# EasyEDA Pro project ProDoc_飞镖核心板_2.5.0_2025-09-09.epro, board PCB1
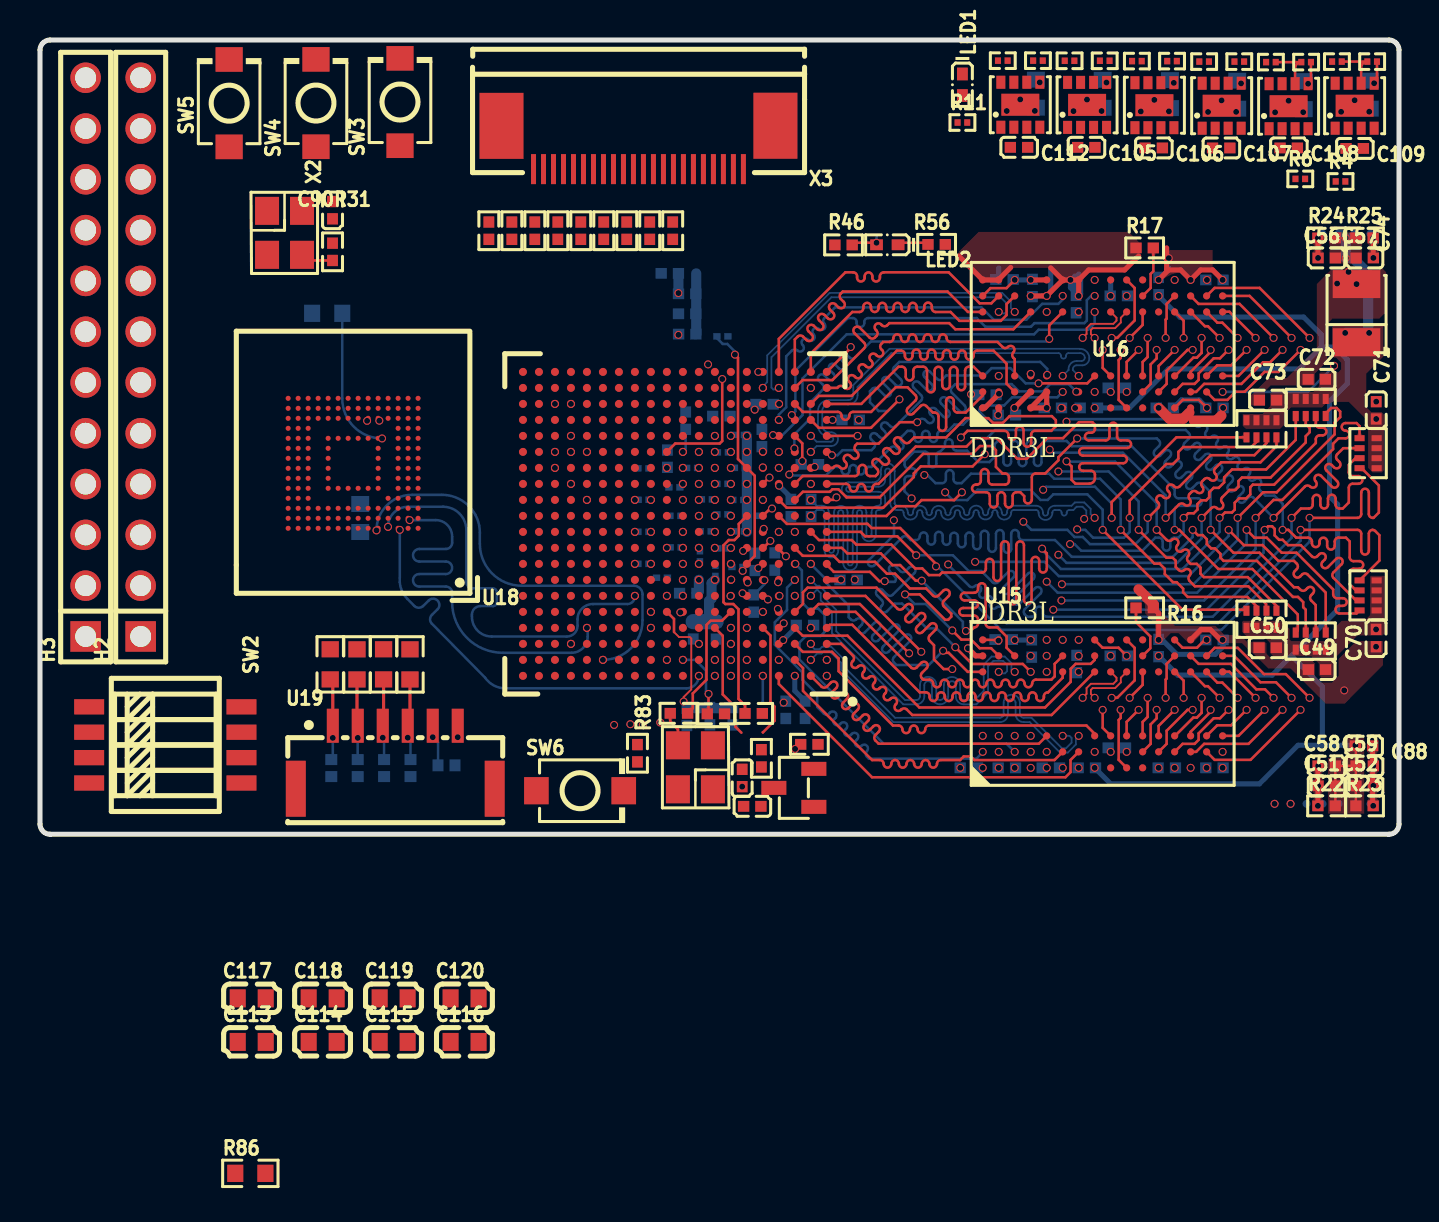
[diagram p7: board, top side]
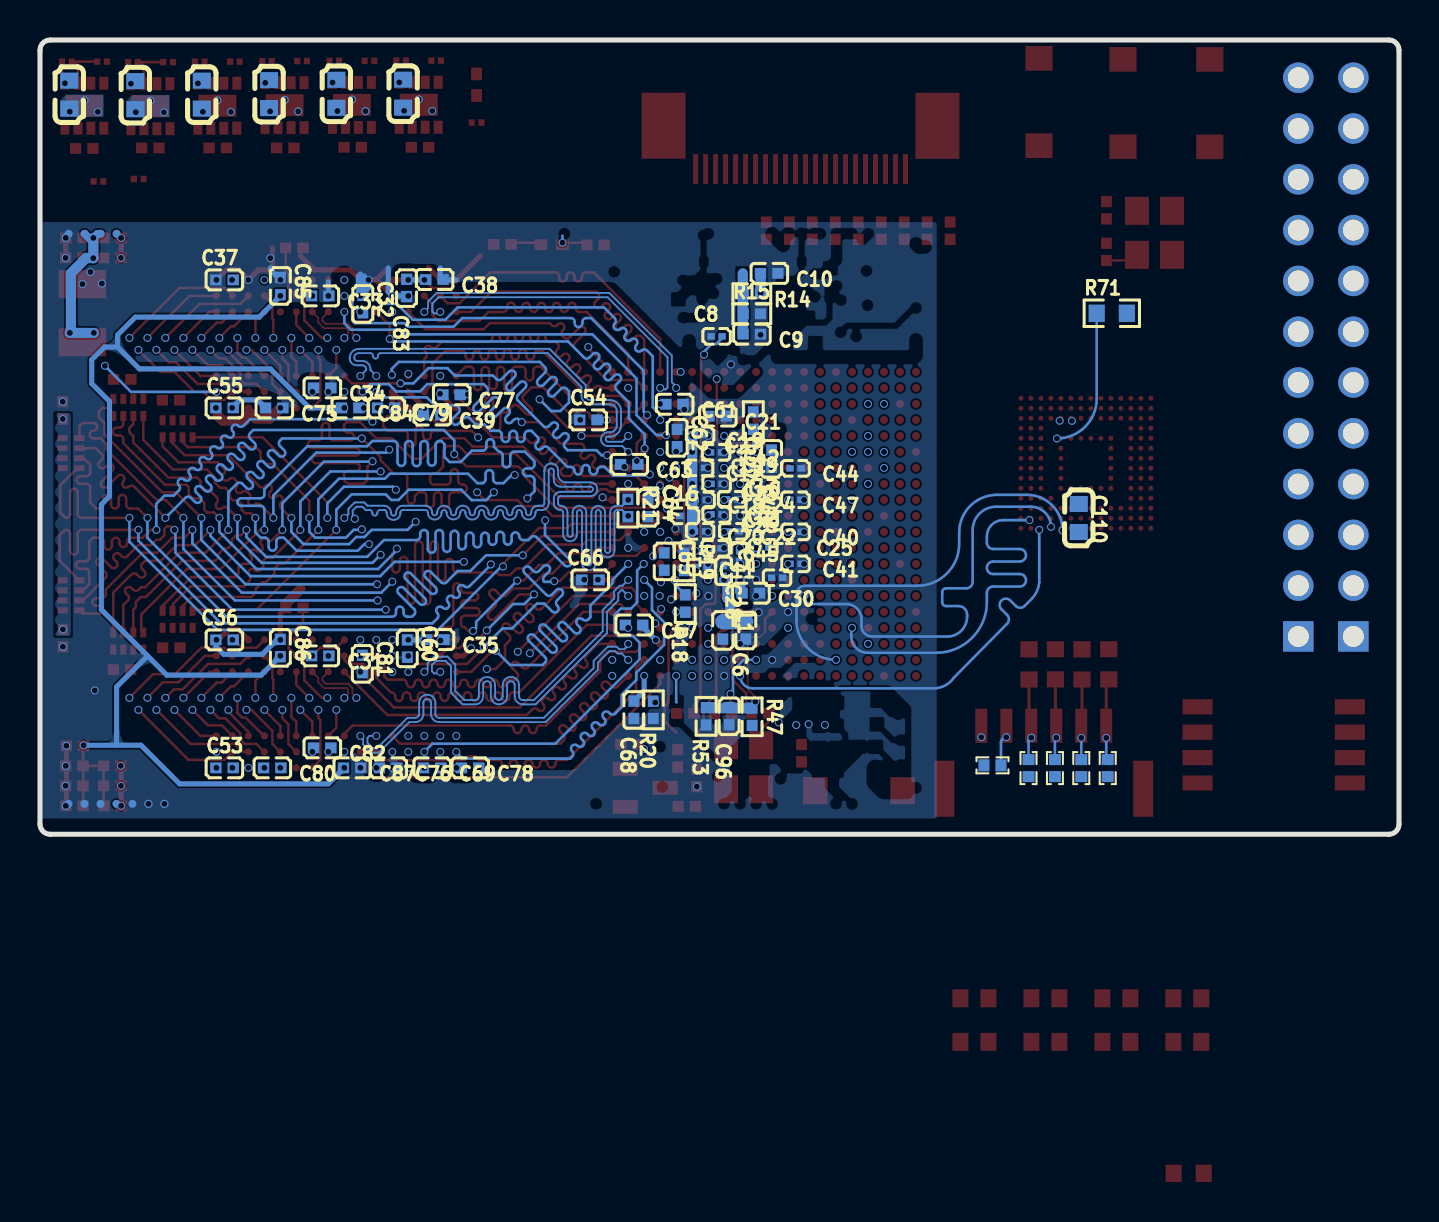
[diagram p8: board, bottom side, seen from below]

Outline 67.99 x 39.72 mm; copper layers: Top Layer, 地层1, 电源层, 信号层, 地层2, Bottom Layer. Coordinates in mm from the lower left corner of the outline.
Outline path: 0,39.21 0,0.51 arc(0.15,0.15) 0.51,0 67.48,0 arc(67.84,0.15) 67.99,0.51 67.99,39.21 arc(67.84,39.57) 67.48,39.72 0.51,39.72 arc(0.15,39.57) 0,39.21
Stack: Top Layer 0.035mm 外层铜厚1oz / Dielectric1 0.0994mm 3313 RC57% 4.2mil / 地层1 0.035mm / Dielectric2 0.55mm 0.55mm H/H No copper / 电源层 0.035mm / Dielectric3 0.1088mm 2116 RC54% 4.9mil / 信号层 0.035mm / Dielectric4 0.55mm 0.55mm H/H No copper / 地层2 0.035mm / Dielectric5 0.0994mm 3313 RC57% 4.2mil / Bottom Layer 0.035mm 外层铜厚1oz

## Design rules (mm)
net SDQS0N: DP4
net SDQS0P: DP4
net SDQS1N: DP3
net SDQS1P: DP3
net SCKP: DP1
net SCKN: DP1
net SDQS2P: DP5
net SDQS2N: DP5
net SDQS3N: DP2
net SDQS3P: DP2
net PL_MIPI_MDP_0: DP6
net PL_MIPI_MDN_0: DP6
net MIPI_MDN_0: DP7
net MIPI_MDP_0: DP7
template: 自定义配置
spacing copperThickness1oz (default): track to track 0.089, other pairs 0.089 to 0.3
spacing copperThickness2oz: track to track 0.203, other pairs 0.152 to 0.3
track width copperThickness1oz (default): min 0.089, default 0.127, max 2.54
track width copperThickness2oz: min 0.203, default 0.254, max 2.54
differential pair differentialPair (default): width min 0.089, default 0.089, max 2.54; gap min 0.124, default 0.127
via viaSize (default): diameter min 0.399, default 0.399, max 10; hole min 0.3, default 0.3, max 6.299
net SDQM0 uses DQ0~7
net SDQ2 uses DQ0~7
net SDQ3 uses DQ0~7
net SDQ6 uses DQ0~7
net SDQ5 uses DQ0~7
net SDQ7 uses DQ0~7
net SDQM1 uses DQ8~15
net SDQ14 uses DQ8~15
net SDQ15 uses DQ8~15
net SDQS0N uses DQ0~7
net SDQ1 uses DQ0~7
net SDQS0P uses DQ0~7
net SDQ0 uses DQ0~7
net SDQ4 uses DQ0~7
net SA13 uses SA
net SDQ8 uses DQ8~15
net SDQ9 uses DQ8~15
net SA12 uses SA
net SDQS1N uses DQ8~15
net SA14 uses SA
net SA11 uses SA
net SDQ10 uses DQ8~15
net SDQS1P uses DQ8~15
net SDQ13 uses DQ8~15
net SDQ11 uses DQ8~15
net SA9 uses SA
net SDQ12 uses DQ8~15
net SA8 uses SA
net SA1 uses SA
net SA3 uses SA
net SA7 uses SA
net SA6 uses SA
net SCKP uses CLK
net SA5 uses SA
net SCKN uses CLK
net SA2 uses SA
net SA4 uses SA
net SRAS uses SA
net SBA1 uses SA
net SCKE uses SA
net SA0 uses SA
net SCS uses SA
net SA10 uses SA
net SBA2 uses SA
net SBA0 uses SA
net SWE uses SA
net SCAS uses SA
net SODT uses SA
net SDQ18 uses DQ16~23
net SDQ17 uses DQ16~23
net SDQS2P uses DQ16~23
net SDQ16 uses DQ16~23
net SDQ19 uses DQ16~23
net SDQM2 uses DQ16~23
net SDQS2N uses DQ16~23
net SDQ20 uses DQ16~23
net SDQ24 uses DQ24~31
net SDQ26 uses DQ24~31
net SDQM3 uses DQ24~31
net SDQ28 uses DQ24~31
net SDQ25 uses DQ24~31
net SDQ27 uses DQ24~31
net SDQ29 uses DQ24~31
net SDQS3N uses DQ24~31
net SDQS3P uses DQ24~31
net SDQ30 uses DQ24~31
net SDQ31 uses DQ24~31
net SDQ22 uses DQ16~23
net SDQ23 uses DQ16~23
net SDQ21 uses DQ16~23
eq len grp DQ0~7 uses DQ0~7
eq len grp DQ8~15 uses DQ8~15
eq len grp SA uses SA
eq len grp CLK uses CLK
eq len grp DQ16~23 uses DQ16~23
eq len grp DQ24~31 uses DQ24~31
region e454 uses 1
region e455 uses 1
region e456 uses 1

## Placement (name value [footprint] x y rotation side)
C1  22uF  [C0603]  66.52 36.99 90 bottom
C2  22uF  [C0603]  63.22 36.96 90 bottom
C3  22uF  [C0603]  59.89 36.99 90 bottom
C4  22uF  [C0603]  56.53 37.01 90 bottom
C5  22uF  [C0603]  53.16 37.03 90 bottom
C6  10uF  [C0402_NEW]  32.68 10.19 90 bottom
C7  470nF  [c0201]  33.79 13.17 270 bottom
C8  100nF  [c0201]  34.14 24.9 180 bottom
C9  10nF  [C0402_NEW]  32.37 25.01 0 bottom
C10  100nF  [C0402_NEW]  31.5 28.05 0 bottom
C11  100nF  [c0201]  34.89 13.37 0 bottom
C16  100nF  [c0201]  35.71 15.92 180 bottom
C17  100nF  [c0201]  35.01 18.32 0 bottom
C18  100nF  [c0201]  34.94 16.72 0 bottom
C19  100nF  [c0201]  34.96 19.97 0 bottom
C20  100nF  [c0201]  34.96 15.15 0 bottom
C21  10uF  [C0402_NEW]  34.08 20.91 0 bottom
C22  100nF  [c0201]  33.3 15.15 0 bottom
C23  100nF  [c0201]  31.79 15.92 180 bottom
C24  100nF  [c0201]  33.36 16.75 0 bottom
C25  100nF  [c0201]  31.11 12.83 0 bottom
C26  100nF  [c0201]  31.8 14.35 180 bottom
C27  100nF  [c0201]  32.62 18.32 180 bottom
C28  100nF  [c0201]  33.01 13.9 90 bottom
C29  100nF  [c0201]  31.74 17.35 180 bottom
C30  10uF  [C0402_NEW]  32.42 12.06 0 bottom
C31  100nF  [C0402_NEW]  53.96 8.92 0 bottom
C32  100nF  [C0402_NEW]  51.83 26.52 270 bottom
C33  100nF  [C0402_NEW]  53.96 26.92 0 bottom
C34  100nF  [C0402_NEW]  53.86 22.32 0 bottom
C35  100nF  [C0402_NEW]  48.2 9.74 0 bottom
C36  100nF  [C0402_NEW]  58.76 9.72 180 bottom
C37  100nF  [C0402_NEW]  58.76 27.72 180 bottom
C38  100nF  [C0402_NEW]  48.24 27.74 0 bottom
C39  10uF  [C0402_NEW]  48.36 20.97 0 bottom
C40  100nF  [c0201]  30.19 15.12 0 bottom
C41  100nF  [c0201]  30.19 13.52 0 bottom
C42  100nF  [c0201]  34.16 19.1 0 bottom
C43  100nF  [c0201]  34.14 16 0 bottom
C44  100nF  [c0201]  30.19 18.3 0 bottom
C45  100nF  [c0201]  34.19 14.3 0 bottom
C46  100nF  [c0201]  34.14 17.52 0 bottom
C47  100nF  [c0201]  30.2 16.73 0 bottom
C48  10uF  [C0402_NEW]  31.39 18.77 90 bottom
C49  100nF  [C0402_NEW]  63.87 8.24 0 top
C50  100nF  [C0402_NEW]  61.41 9.33 0 top
C51  100nF  [C0402_NEW]  64.36 2.42 0 top
C52  100nF  [C0402_NEW]  66.26 2.42 0 top
C53  100nF  [C0402_NEW]  58.76 3.32 180 bottom
C54  100nF  [C0402_NEW]  40.56 20.72 180 bottom
C55  100nF  [C0402_NEW]  58.76 21.32 180 bottom
C56  100nF  [C0402_NEW]  64.36 28.82 0 top
C57  100nF  [C0402_NEW]  66.26 28.82 0 top
C58  10nF  [C0402_NEW]  64.36 3.42 0 top
C59  10nF  [C0402_NEW]  66.26 3.42 0 top
C60  10uF  [C0402_NEW]  49.61 9.3 270 bottom
C61  100nF  [C0402_NEW]  36.24 21.51 0 bottom
C62  100nF  [C0402_NEW]  36.11 19.82 270 bottom
C63  100nF  [C0402_NEW]  38.51 18.5 0 bottom
C64  100nF  [C0402_NEW]  37.57 16.32 270 bottom
C65  100nF  [C0402_NEW]  36.76 13.65 270 bottom
C66  100nF  [C0402_NEW]  40.46 12.72 180 bottom
C67  100nF  [C0402_NEW]  38.26 10.46 0 bottom
C68  100nF  [C0402_NEW]  38.28 6.22 90 bottom
C69  10uF  [C0402_NEW]  48.36 3.32 0 bottom
C70  100nF  [C0402_NEW]  66.84 9.8 90 top
C71  100nF  [C0402_NEW]  66.85 21.21 270 top
C72  100nF  [C0402_NEW]  63.86 22.75 0 top
C73  100nF  [C0402_NEW]  61.43 21.71 0 top
C74  100uF  [cap-smd_l3.5-w2.8-r-rd]  65.86 26.12 270 top
C75  100nF  [C0402_NEW]  56.26 21.32 0 bottom
C76  100nF  [C0402_NEW]  50.56 3.32 0 bottom
C77  100nF  [C0402_NEW]  47.39 21.98 0 bottom
C78  100nF  [C0402_NEW]  46.46 3.32 0 bottom
C79  100nF  [C0402_NEW]  50.66 21.32 0 bottom
C80  100nF  [C0402_NEW]  56.36 3.32 0 bottom
C81  100nF  [C0402_NEW]  51.86 8.52 270 bottom
C82  100nF  [C0402_NEW]  53.86 4.32 0 bottom
C83  10uF  [C0402_NEW]  49.65 27.31 90 bottom
C84  100nF  [C0402_NEW]  52.46 21.32 0 bottom
C85  100nF  [C0402_NEW]  55.96 27.42 270 bottom
C86  100nF  [C0402_NEW]  55.96 9.32 270 bottom
C87  100nF  [C0402_NEW]  52.36 3.32 0 bottom
C88  10uF  [C0402_NEW]  66.24 4.42 180 top
C89  100nF  [C0402_NEW]  35.64 1.4 180 top
C90  100nF  [C0402_NEW]  14.63 31.2 90 top
C96  10nF  [C0402_NEW]  33.51 5.9 90 bottom
C97  100nF  [C0402_NEW]  35.13 2.81 90 top
C105  10uF  [C0402_NEW]  52.35 34.35 180 top
C106  10uF  [C0402_NEW]  55.72 34.32 180 top
C107  10uF  [C0402_NEW]  59.1 34.32 180 top
C108  10uF  [C0402_NEW]  62.48 34.32 180 top
C109  10uF  [C0402_NEW]  65.78 34.3 180 top
C110  100nF  [C0603]  16.02 15.82 270 bottom
C111  22uF  [C0603]  49.82 37.04 90 bottom
C112  10uF  [C0402_NEW]  48.98 34.35 180 top
C113  100nF  [C0603]  10.59 -10.38 0 top
C114  100nF  [C0603]  14.14 -10.38 0 top
C115  100nF  [C0603]  17.69 -10.38 0 top
C116  100nF  [C0603]  21.24 -10.38 0 top
C117  100nF  [C0603]  10.59 -8.2 0 top
C118  100nF  [C0603]  14.14 -8.2 0 top
C119  100nF  [C0603]  17.69 -8.2 0 top
C120  100nF  [C0603]  21.24 -8.2 0 top
H2  PZ254V-11-12P  [HDR-TH_12P-P2.54-V-M]  5.04 23.86 90 top
H3  PZ254V-11-12P  [HDR-TH_12P-P2.54-V-M]  2.28 23.86 90 top
L1  BLM15AG121SN1D  [L0402_NEW]  33.83 10.19 270 bottom
LED1  -  [LED_0402]  46.14 37.48 270 top
LED2  -  [LED_0402]  42.39 29.48 180 top
NOREF  -  [Pad_e12630]  61.76 1.52 90 top
NOREF#2  -  [Pad_e12627]  64.16 1.52 90 top
NOREF#3  -  [Pad_e12628]  63.36 1.52 90 top
NOREF#4  -  [Pad_e12625]  65.76 1.52 90 top
NOREF#5  -  [Pad_e12684]  64.95 30.03 270 top
NOREF#6  -  [Pad_e12629]  62.56 1.52 90 top
NOREF#7  -  [Pad_e12626]  64.96 1.52 90 top
NOREF#8  -  [Pad_e12685]  65.75 30.03 270 top
NOREF#9  -  [Pad_e12686]  66.55 30.03 270 top
NOREF#10  -  [Pad_e12681]  64.15 30.03 270 top
NOREF#11  -  [Pad_e12624]  66.56 1.52 90 top
R1  12.4K  [r0201]  66.64 38.64 0 top
R2  49.9K  [r0201]  64.88 38.64 0 top
R3  12.4K  [r0201]  63.34 38.61 0 top
R4  10K  [r0201]  65.06 32.65 0 top
R5  10K  [r0201]  61.58 38.61 0 top
R6  10K  [r0201]  63.05 32.77 0 top
R7  10K  [r0201]  59.99 38.64 0 top
R8  20K  [r0201]  58.24 38.64 0 top
R9  10K  [r0201]  56.63 38.66 0 top
R10  10K  [r0201]  54.87 38.67 0 top
R11  4.7K  [r0201]  46.14 35.59 0 top
R12  38.3K  [r0201]  53.26 38.68 0 top
R13  12.4K  [r0201]  51.5 38.68 0 top
R14  1kΩ  [R0402_NEW]  32.37 27.03 0 bottom
R15  1kΩ  [R0402_NEW]  32.37 26.03 180 bottom
R16  240Ω  [R0402_NEW]  55.26 11.32 180 top
R17  240Ω  [R0402_NEW]  55.26 29.32 0 top
R18  80.6Ω  [R0402_NEW]  35.7 11.54 90 bottom
R19  80.6Ω  [R0402_NEW]  35.76 13.62 270 bottom
R20  4.7kΩ  [R0402_NEW]  37.31 6.22 90 bottom
R21  100Ω  [R0402_NEW]  38.58 16.31 270 bottom
R22  1kΩ  [R0402_NEW]  64.36 1.42 0 top
R23  1kΩ  [R0402_NEW]  66.26 1.42 0 top
R24  1kΩ  [R0402_NEW]  64.36 29.82 0 top
R25  1kΩ  [R0402_NEW]  66.26 29.82 0 top
R27  4.7kΩ  [R0402_NEW]  32.3 20.68 90 bottom
R28  4.7kΩ  [R0402_NEW]  35.7 6.04 0 top
R29  10kΩ  [R0402_NEW]  33.81 6.02 180 top
R30  33Ω  [R0402_NEW]  31.96 6.05 0 top
R31  33Ω  [R0402_NEW]  14.63 29.13 90 top
R32  100Ω  [R0402]  22.45 30.18 90 top
R33  150  [R0402]  23.6 30.18 90 top
R34  100Ω  [R0402]  24.75 30.18 90 top
R35  100Ω  [R0402]  25.9 30.18 90 top
R36  150  [R0402]  27.05 30.18 90 top
R38  100Ω  [R0402]  28.2 30.18 90 top
R41  100Ω  [R0402]  29.35 30.18 90 top
R42  150  [R0402]  30.5 30.18 90 top
R43  100Ω  [R0402]  31.65 30.18 90 top
R46  4.7kΩ  [R0402_NEW]  40.2 29.47 0 top
R47  1kΩ  [R0402_NEW]  32.36 5.87 270 bottom
R51  4.7kΩ  [R0402_NEW]  36.09 3.8 90 top
R53  1kΩ  [R0402_NEW]  34.66 5.9 90 bottom
R55  22Ω  [R0402_NEW]  38.49 4.5 180 top
R56  4.7kΩ  [R0402_NEW]  44.85 29.5 0 top
R71  10K  [R0603]  14.37 26.05 180 bottom
R72  39R  [R0603]  14.52 8.5 270 top
R73  39R  [R0603]  15.86 8.5 270 top
R74  39R  [R0603]  17.19 8.5 270 top
R75  39R  [R0603]  18.51 8.5 270 top
R83  4.7kΩ  [R0402_NEW]  29.89 4.05 270 top
R84  2K  [r0201]  48.17 38.69 0 top
R85  10.5K  [r0201]  49.92 38.69 0 top
R86  33R  [R0603]  10.52 -16.96 0 top
RN1  49.9Ω  [RES-ARRAY-SMD_0402-8P-L2.0-W1.0-BL]  66.44 11.95 90 top
RN2  49.9Ω  [RES-ARRAY-SMD_0402-8P-L2.0-W1.0-BL]  61.11 20.28 180 top
RN3  49.9Ω  [RES-ARRAY-SMD_0402-8P-L2.0-W1.0-BL]  63.57 9.66 0 top
RN4  49.9Ω  [RES-ARRAY-SMD_0402-8P-L2.0-W1.0-BL]  63.57 21.34 180 top
RN5  49.9Ω  [RES-ARRAY-SMD_0402-8P-L2.0-W1.0-BL]  61.11 10.75 0 top
RN6  49.9Ω  [RES-ARRAY-SMD_0402-8P-L2.0-W1.0-BL]  66.44 19.06 90 top
SW2  DSHP04TS-S  [SW-SMD_8P-L6.7-W5.4-P1.27-LS8.5]  6.27 4.47 270 top
SW3  TS-1088-AR02016  [SW-SMD_L3.9-W3.0-P4.45]  18.01 36.62 90 top
SW4  TS-1088-AR02016  [SW-SMD_L3.9-W3.0-P4.45]  13.81 36.57 90 top
SW5  TS-1088-AR02016  [SW-SMD_L3.9-W3.0-P4.45]  9.46 36.56 90 top
SW6  TS-1088-AR02016  [SW-SMD_L3.9-W3.0-P4.45]  27.02 2.18 0 top
U1  TPS82130SILR  [USIP-8_L3.0-W2.8-P0.65-TL-EP]  65.77 36.43 90 top
U2  TPS82130SILR  [USIP-8_L3.0-W2.8-P0.65-TL-EP]  62.46 36.41 90 top
U3  TPS82130SILR  [USIP-8_L3.0-W2.8-P0.65-TL-EP]  59.11 36.43 90 top
U4  TPS82130SILR  [USIP-8_L3.0-W2.8-P0.65-TL-EP]  55.75 36.46 90 top
U5  TPS82130SILR  [USIP-8_L3.0-W2.8-P0.65-TL-EP]  52.38 36.48 90 top
U13  MAX809T  [SOT-23-3_L2.9-W1.3-P1.90-LS2.4-BR]  37.71 2.32 0 top
U15  NT5CC256M16ER-EK  [TFBGA-96_L13.0-W8.0-R16-C6-P0.80-TL]  53.16 6.52 90 top
U16  NT5CC256M16ER-EK  [TFBGA-96_L13.0-W8.0-R16-C6-P0.80-TL]  53.16 24.52 90 top
U17  XC7Z020-2CLG400I  [FBGA-400_L17.0-W17.0-R20-C20-P0.80-TL]  31.76 15.52 180 top
U18  KLMAG1JETD-B041  [FBGA-153_L13.0-W11.5-P0.50_KLMAG1JETD-B041]  15.66 18.55 180 top
U19  WAFER-GH1.25-6PWB  [CONN-SMD_6P-P1.25_XUNPU_WAFER-GH1.25-6PWB]  17.77 3.85 0 top
U20  H3V3L10B  [DFN1006-2L-BI]  14.57 3.31 90 bottom
U21  H3V3L10B  [DFN1006-2L-BI]  15.89 3.31 90 bottom
U22  H3V3L10B  [DFN1006-2L-BI]  17.21 3.31 90 bottom
U23  H3V3L10B  [DFN1006-2L-BI]  18.53 3.31 90 bottom
U24  H3V3L10B  [DFN1006-2L-BI]  20.34 3.45 180 bottom
U25  TPS82130SILR  [USIP-8_L3.0-W2.8-P0.65-TL-EP]  49.04 36.48 90 top
X1  33.333333MHz  [OSC-SMD_4P-L3.2-W2.5-BL]  32.79 3.35 90 top
X2  50MHz  [OSC-SMD_4P-L3.2-W2.5-BL]  12.23 30.08 270 top
X3  AFC07-S22ECA-00  [FPC-SMD_AFC07-S22ECA-00]  29.94 34.35 180 top

## Footprints (pads in the part's own frame, mm; a bottom-side part is the same pattern mirrored in y, then rotated)
c0201
  rect 0.368x0.324 smd: 1(-0.275,0) 2(0.275,0)
C0402_NEW
  rect 0.566x0.54 smd: 1(-0.425,0) 2(0.441,0)
C0603
  rect 0.8x0.9 smd: 1(-0.7,0) 2(0.7,0)
cap-smd_l3.5-w2.8-r-rd
  rect 1.4x2.376 smd: 1(1.518,0) 2(-1.391,0)
CONN-SMD_6P-P1.25_XUNPU_WAFER-GH1.25-6PWB
  rect 0.6x1.7 smd: 1(-3.125,1.575) 2(-1.875,1.575) 3(-0.625,1.575) 4(0.625,1.575) 5(1.875,1.575) 6(3.125,1.575)
  rect 1x2.8 smd: 7(4.975,-1.575) 8(-4.975,-1.575)
DFN1006-2L-BI
  rect 0.55x0.6 smd: 1(-0.425,0) 2(0.425,0)
FBGA-153_L13.0-W11.5-P0.50_KLMAG1JETD-B041
  round 0.25 smd: A1(-3.25,3.25) A2(-2.75,3.25) A3(-2.25,3.25) A4(-1.75,3.25) A5(-1.25,3.25) A6(-0.75,3.25) A7(-0.25,3.25) A8(0.25,3.25) A9(0.75,3.25) A10(1.25,3.25) A11(1.75,3.25) A12(2.25,3.25) A13(2.75,3.25) A14(3.25,3.25) B1(-3.25,2.75) B2(-2.75,2.75) B3(-2.25,2.75) B4(-1.75,2.75) B5(-1.25,2.75) B6(-0.75,2.75) B7(-0.25,2.75) B8(0.25,2.75) B9(0.75,2.75) B10(1.25,2.75) B11(1.75,2.75) B12(2.25,2.75) B13(2.75,2.75) B14(3.25,2.75) C1(-3.25,2.25) C2(-2.75,2.25) C3(-2.25,2.25) C4(-1.75,2.25) C5(-1.25,2.25) C6(-0.75,2.25) C7(-0.25,2.25) C8(0.25,2.25) C9(0.75,2.25) C10(1.25,2.25) C11(1.75,2.25) C12(2.25,2.25) C13(2.75,2.25) C14(3.25,2.25) D1(-3.25,1.75) D2(-2.75,1.75) D3(-2.25,1.75) D4(-1.75,1.75) D12(2.25,1.75) D13(2.75,1.75) D14(3.25,1.75) E1(-3.25,1.25) E2(-2.75,1.25) E3(-2.25,1.25) E5(-1.25,1.25) E6(-0.75,1.25) E7(-0.25,1.25) E8(0.25,1.25) E9(0.75,1.25) E10(1.25,1.25) E12(2.25,1.25) E13(2.75,1.25) E14(3.25,1.25) F1(-3.25,0.75) F2(-2.75,0.75) F3(-2.25,0.75) F5(-1.25,0.75) F10(1.25,0.75) F12(2.25,0.75) F13(2.75,0.75) F14(3.25,0.75) G1(-3.25,0.25) G2(-2.75,0.25) G3(-2.25,0.25) G5(-1.25,0.25) G10(1.25,0.25) G12(2.25,0.25) G13(2.75,0.25) G14(3.25,0.25) H1(-3.25,-0.25) H2(-2.75,-0.25) H3(-2.25,-0.25) H5(-1.25,-0.25) H10(1.25,-0.25) H12(2.25,-0.25) H13(2.75,-0.25) H14(3.25,-0.25) J1(-3.25,-0.75) J2(-2.75,-0.75) J3(-2.25,-0.75) J5(-1.25,-0.75) J10(1.25,-0.75) J12(2.25,-0.75) J13(2.75,-0.75) J14(3.25,-0.75) K1(-3.25,-1.25) K2(-2.75,-1.25) K3(-2.25,-1.25) K5(-1.25,-1.25) K6(-0.75,-1.25) K7(-0.25,-1.25) K8(0.25,-1.25) K9(0.75,-1.25) K10(1.25,-1.25) K12(2.25,-1.25) K13(2.75,-1.25) K14(3.25,-1.25) L1(-3.25,-1.75) L2(-2.75,-1.75) L3(-2.25,-1.75) L12(2.25,-1.75) L13(2.75,-1.75) L14(3.25,-1.75) M1(-3.25,-2.25) M2(-2.75,-2.25) M3(-2.25,-2.25) M4(-1.75,-2.25) M5(-1.25,-2.25) M6(-0.75,-2.25) M7(-0.25,-2.25) M8(0.25,-2.25) M9(0.75,-2.25) M10(1.25,-2.25) M11(1.75,-2.25) M12(2.25,-2.25) M13(2.75,-2.25) M14(3.25,-2.25) N1(-3.25,-2.75) N2(-2.75,-2.75) N3(-2.25,-2.75) N4(-1.75,-2.75) N5(-1.25,-2.75) N6(-0.75,-2.75) N7(-0.25,-2.75) N8(0.25,-2.75) N9(0.75,-2.75) N10(1.25,-2.75) N11(1.75,-2.75) N12(2.25,-2.75) N13(2.75,-2.75) N14(3.25,-2.75) P1(-3.25,-3.25) P2(-2.75,-3.25) P3(-2.25,-3.25) P4(-1.75,-3.25) P5(-1.25,-3.25) P6(-0.75,-3.25) P7(-0.25,-3.25) P8(0.25,-3.25) P9(0.75,-3.25) P10(1.25,-3.25) P11(1.75,-3.25) P12(2.25,-3.25) P13(2.75,-3.25) P14(3.25,-3.25)
FBGA-400_L17.0-W17.0-R20-C20-P0.80-TL
  round 0.4 smd: A1(-7.6,7.6) A2(-6.8,7.6) A3(-6,7.6) A4(-5.2,7.6) A5(-4.4,7.6) A6(-3.6,7.6) A7(-2.8,7.6) A8(-2,7.6) A9(-1.2,7.6) A10(-0.4,7.6) A11(0.4,7.6) A12(1.2,7.6) A13(2,7.6) A14(2.8,7.6) A15(3.6,7.6) A16(4.4,7.6) A17(5.2,7.6) A18(6,7.6) A19(6.8,7.6) A20(7.6,7.6) B1(-7.6,6.8) B2(-6.8,6.8) B3(-6,6.8) B4(-5.2,6.8) B5(-4.4,6.8) B6(-3.6,6.8) B7(-2.8,6.8) B8(-2,6.8) B9(-1.2,6.8) B10(-0.4,6.8) B11(0.4,6.8) B12(1.2,6.8) B13(2,6.8) B14(2.8,6.8) B15(3.6,6.8) B16(4.4,6.8) B17(5.2,6.8) B18(6,6.8) B19(6.8,6.8) B20(7.6,6.8) C1(-7.6,6) C2(-6.8,6) C3(-6,6) C4(-5.2,6) C5(-4.4,6) C6(-3.6,6) C7(-2.8,6) C8(-2,6) C9(-1.2,6) C10(-0.4,6) C11(0.4,6) C12(1.2,6) C13(2,6) C14(2.8,6) C15(3.6,6) C16(4.4,6) C17(5.2,6) C18(6,6) C19(6.8,6) C20(7.6,6) D1(-7.6,5.2) D2(-6.8,5.2) D3(-6,5.2) D4(-5.2,5.2) D5(-4.4,5.2) D6(-3.6,5.2) D7(-2.8,5.2) D8(-2,5.2) D9(-1.2,5.2) D10(-0.4,5.2) D11(0.4,5.2) D12(1.2,5.2) D13(2,5.2) D14(2.8,5.2) D15(3.6,5.2) D16(4.4,5.2) D17(5.2,5.2) D18(6,5.2) D19(6.8,5.2) D20(7.6,5.2) E1(-7.6,4.4) E2(-6.8,4.4) E3(-6,4.4) E4(-5.2,4.4) E5(-4.4,4.4) E6(-3.6,4.4) E7(-2.8,4.4) E8(-2,4.4) E9(-1.2,4.4) E10(-0.4,4.4) E11(0.4,4.4) E12(1.2,4.4) E13(2,4.4) E14(2.8,4.4) E15(3.6,4.4) E16(4.4,4.4) E17(5.2,4.4) E18(6,4.4) E19(6.8,4.4) E20(7.6,4.4) F1(-7.6,3.6) F2(-6.8,3.6) F3(-6,3.6) F4(-5.2,3.6) F5(-4.4,3.6) F6(-3.6,3.6) F7(-2.8,3.6) F8(-2,3.6) F9(-1.2,3.6) F10(-0.4,3.6) F11(0.4,3.6) F12(1.2,3.6) F13(2,3.6) F14(2.8,3.6) F15(3.6,3.6) F16(4.4,3.6) F17(5.2,3.6) F18(6,3.6) F19(6.8,3.6) F20(7.6,3.6) G1(-7.6,2.8) G2(-6.8,2.8) G3(-6,2.8) G4(-5.2,2.8) G5(-4.4,2.8) G6(-3.6,2.8) G7(-2.8,2.8) G8(-2,2.8) G9(-1.2,2.8) G10(-0.4,2.8) G11(0.4,2.8) G12(1.2,2.8) G13(2,2.8) G14(2.8,2.8) G15(3.6,2.8) G16(4.4,2.8) G17(5.2,2.8) G18(6,2.8) G19(6.8,2.8) G20(7.6,2.8) H1(-7.6,2) H2(-6.8,2) H3(-6,2) H4(-5.2,2) H5(-4.4,2) H6(-3.6,2) H7(-2.8,2) H8(-2,2) H9(-1.2,2) H10(-0.4,2) H11(0.4,2) H12(1.2,2) H13(2,2) H14(2.8,2) H15(3.6,2) H16(4.4,2) H17(5.2,2) H18(6,2) H19(6.8,2) H20(7.6,2) J1(-7.6,1.2) J2(-6.8,1.2) J3(-6,1.2) J4(-5.2,1.2) J5(-4.4,1.2) J6(-3.6,1.2) J7(-2.8,1.2) J8(-2,1.2) J9(-1.2,1.2) J10(-0.4,1.2) J11(0.4,1.2) J12(1.2,1.2) J13(2,1.2) J14(2.8,1.2) J15(3.6,1.2) J16(4.4,1.2) J17(5.2,1.2) J18(6,1.2) J19(6.8,1.2) J20(7.6,1.2) K1(-7.6,0.4) K2(-6.8,0.4) K3(-6,0.4) K4(-5.2,0.4) K5(-4.4,0.4) K6(-3.6,0.4) K7(-2.8,0.4) K8(-2,0.4) K9(-1.2,0.4) K10(-0.4,0.4) K11(0.4,0.4) K12(1.2,0.4) K13(2,0.4) K14(2.8,0.4) K15(3.6,0.4) K16(4.4,0.4) K17(5.2,0.4) K18(6,0.4) K19(6.8,0.4) K20(7.6,0.4) L1(-7.6,-0.4) L2(-6.8,-0.4) L3(-6,-0.4) L4(-5.2,-0.4) L5(-4.4,-0.4) L6(-3.6,-0.4) L7(-2.8,-0.4) L8(-2,-0.4) L9(-1.2,-0.4) L10(-0.4,-0.4) L11(0.4,-0.4) L12(1.2,-0.4) L13(2,-0.4) L14(2.8,-0.4) L15(3.6,-0.4) L16(4.4,-0.4) L17(5.2,-0.4) L18(6,-0.4) L19(6.8,-0.4) L20(7.6,-0.4) M1(-7.6,-1.2) M2(-6.8,-1.2) M3(-6,-1.2) M4(-5.2,-1.2) M5(-4.4,-1.2) M6(-3.6,-1.2) M7(-2.8,-1.2) M8(-2,-1.2) M9(-1.2,-1.2) M10(-0.4,-1.2) M11(0.4,-1.2) M12(1.2,-1.2) M13(2,-1.2) M14(2.8,-1.2) M15(3.6,-1.2) M16(4.4,-1.2) M17(5.2,-1.2) M18(6,-1.2) M19(6.8,-1.2) M20(7.6,-1.2) N1(-7.6,-2) N2(-6.8,-2) N3(-6,-2) N4(-5.2,-2) N5(-4.4,-2) N6(-3.6,-2) N7(-2.8,-2) N8(-2,-2) N9(-1.2,-2) N10(-0.4,-2) N11(0.4,-2) N12(1.2,-2) N13(2,-2) N14(2.8,-2) N15(3.6,-2) N16(4.4,-2) N17(5.2,-2) N18(6,-2) N19(6.8,-2) N20(7.6,-2) P1(-7.6,-2.8) P2(-6.8,-2.8) P3(-6,-2.8) P4(-5.2,-2.8) P5(-4.4,-2.8) P6(-3.6,-2.8) P7(-2.8,-2.8) P8(-2,-2.8) P9(-1.2,-2.8) P10(-0.4,-2.8) P11(0.4,-2.8) P12(1.2,-2.8) P13(2,-2.8) P14(2.8,-2.8) P15(3.6,-2.8) P16(4.4,-2.8) P17(5.2,-2.8) P18(6,-2.8) P19(6.8,-2.8) P20(7.6,-2.8) R1(-7.6,-3.6) R2(-6.8,-3.6) R3(-6,-3.6) R4(-5.2,-3.6) R5(-4.4,-3.6) R6(-3.6,-3.6) R7(-2.8,-3.6) R8(-2,-3.6) R9(-1.2,-3.6) R10(-0.4,-3.6) R11(0.4,-3.6) R12(1.2,-3.6) R13(2,-3.6) R14(2.8,-3.6) R15(3.6,-3.6) R16(4.4,-3.6) R17(5.2,-3.6) R18(6,-3.6) R19(6.8,-3.6) R20(7.6,-3.6) T1(-7.6,-4.4) T2(-6.8,-4.4) T3(-6,-4.4) T4(-5.2,-4.4) T5(-4.4,-4.4) T6(-3.6,-4.4) T7(-2.8,-4.4) T8(-2,-4.4) T9(-1.2,-4.4) T10(-0.4,-4.4) T11(0.4,-4.4) T12(1.2,-4.4) T13(2,-4.4) T14(2.8,-4.4) T15(3.6,-4.4) T16(4.4,-4.4) T17(5.2,-4.4) T18(6,-4.4) T19(6.8,-4.4) T20(7.6,-4.4) U1(-7.6,-5.2) U2(-6.8,-5.2) U3(-6,-5.2) U4(-5.2,-5.2) U5(-4.4,-5.2) U6(-3.6,-5.2) U7(-2.8,-5.2) U8(-2,-5.2) U9(-1.2,-5.2) U10(-0.4,-5.2) U11(0.4,-5.2) U12(1.2,-5.2) U13(2,-5.2) U14(2.8,-5.2) U15(3.6,-5.2) U16(4.4,-5.2) U17(5.2,-5.2) U18(6,-5.2) U19(6.8,-5.2) U20(7.6,-5.2) V1(-7.6,-6) V2(-6.8,-6) V3(-6,-6) V4(-5.2,-6) V5(-4.4,-6) V6(-3.6,-6) V7(-2.8,-6) V8(-2,-6) V9(-1.2,-6) V10(-0.4,-6) V11(0.4,-6) V12(1.2,-6) V13(2,-6) V14(2.8,-6) V15(3.6,-6) V16(4.4,-6) V17(5.2,-6) V18(6,-6) V19(6.8,-6) V20(7.6,-6) W1(-7.6,-6.8) W2(-6.8,-6.8) W3(-6,-6.8) W4(-5.2,-6.8) W5(-4.4,-6.8) W6(-3.6,-6.8) W7(-2.8,-6.8) W8(-2,-6.8) W9(-1.2,-6.8) W10(-0.4,-6.8) W11(0.4,-6.8) W12(1.2,-6.8) W13(2,-6.8) W14(2.8,-6.8) W15(3.6,-6.8) W16(4.4,-6.8) W17(5.2,-6.8) W18(6,-6.8) W19(6.8,-6.8) W20(7.6,-6.8) Y1(-7.6,-7.6) Y2(-6.8,-7.6) Y3(-6,-7.6) Y4(-5.2,-7.6) Y5(-4.4,-7.6) Y6(-3.6,-7.6) Y7(-2.8,-7.6) Y8(-2,-7.6) Y9(-1.2,-7.6) Y10(-0.4,-7.6) Y11(0.4,-7.6) Y12(1.2,-7.6) Y13(2,-7.6) Y14(2.8,-7.6) Y15(3.6,-7.6) Y16(4.4,-7.6) Y17(5.2,-7.6) Y18(6,-7.6) Y19(6.8,-7.6) Y20(7.6,-7.6)
FPC-SMD_AFC07-S22ECA-00
  rect 0.25x1.5 smd: 1(-5.25,1.085) 2(-4.75,1.085) 3(-4.25,1.085) 4(-3.75,1.085) 5(-3.25,1.085) 6(-2.75,1.085) 7(-2.25,1.085) 8(-1.75,1.085) 9(-1.25,1.085) 10(-0.75,1.085) 11(-0.25,1.085) 12(0.25,1.085) 13(0.75,1.085) 14(1.25,1.085) 15(1.75,1.085) 16(2.25,1.085) 17(2.75,1.085) 18(3.25,1.085) 19(3.75,1.085) 20(4.25,1.085) 21(4.75,1.085) 22(5.25,1.085)
  rect 2.2x3.3 smd: 23(6.851,-1.079) 24(-6.851,-1.085)
HDR-TH_12P-P2.54-V-M
  rect 1.524x1.524 hole 1.05: 1(-13.97,0)
  round 1.524 hole 1.05: 2(-11.43,0) 3(-8.89,0) 4(-6.35,0) 5(-3.81,0) 6(-1.27,0) 7(1.27,0) 8(3.81,0) 9(6.35,0) 10(8.89,0) 11(11.43,0) 12(13.97,0)
L0402_NEW
  rect 0.566x0.54 smd: 1(-0.433,0) 2(0.433,0)
LED_0402
  rect 0.637x0.541 smd: 1(-0.538,0) 2(0.538,0)
OSC-SMD_4P-L3.2-W2.5-BL
  rect 1.4x1.2 smd: 1(-1.1,-0.875) 2(1.1,-0.875) 3(1.1,0.875) 4(-1.1,0.875)
Pad_e12624
  round 0.4 smd far side: E10(0,0)
Pad_e12625
  round 0.4 smd far side: E10(0,0)
Pad_e12626
  round 0.4 smd far side: E10(0,0)
Pad_e12627
  round 0.4 smd far side: E10(0,0)
Pad_e12628
  round 0.4 smd far side: E10(0,0)
Pad_e12629
  round 0.4 smd far side: E10(0,0)
Pad_e12630
  round 0.4 smd far side: E10(0,0)
Pad_e12681
  round 0.4 smd far side: E10(0,0)
Pad_e12684
  round 0.4 smd far side: E10(0,0)
Pad_e12685
  round 0.4 smd far side: E10(0,0)
Pad_e12686
  round 0.4 smd far side: E10(0,0)
r0201
  rect 0.303x0.324 smd: 1(-0.241,0) 2(0.241,0)
R0402
  rect 0.566x0.54 smd: 1(-0.433,0) 2(0.433,0)
R0402_NEW
  rect 0.566x0.54 smd: 1(-0.433,0) 2(0.433,0)
R0603
  rect 0.806x0.864 smd: 1(-0.753,0) 2(0.753,0)
RES-ARRAY-SMD_0402-8P-L2.0-W1.0-BL
  rect 0.3x0.505 smd: 1(-0.75,0.427) 2(-0.25,0.427) 3(0.25,0.427) 4(0.75,0.427) 5(0.75,-0.427) 6(0.25,-0.427) 7(-0.25,-0.427) 8(-0.75,-0.427)
SOT-23-3_L2.9-W1.3-P1.90-LS2.4-BR
  rect 1.25x0.7 smd: 1(1,-0.95) 2(1,0.95) 3(-1,0)
SW-SMD_8P-L6.7-W5.4-P1.27-LS8.5
  rect 0.762x1.5 smd: 1(-1.905,-3.81) 2(-0.635,-3.81) 3(0.635,-3.81) 4(1.905,-3.81) 5(1.905,3.81) 6(0.635,3.81) 7(-0.635,3.81) 8(-1.905,3.81)
SW-SMD_L3.9-W3.0-P4.45
  rect 1.23x1.36 smd: 1(-2.185,0) 2(2.185,0)
TFBGA-96_L13.0-W8.0-R16-C6-P0.80-TL
  round 0.36 smd: A1(-3.2,6) A2(-2.4,6) A3(-1.6,6) A7(1.6,6) A8(2.4,6) A9(3.2,6) B1(-3.2,5.2) B2(-2.4,5.2) B3(-1.6,5.2) B7(1.6,5.2) B8(2.4,5.2) B9(3.2,5.2) C1(-3.2,4.4) C2(-2.4,4.4) C3(-1.6,4.4) C7(1.6,4.4) C8(2.4,4.4) C9(3.2,4.4) D1(-3.2,3.6) D2(-2.4,3.6) D3(-1.6,3.6) D7(1.6,3.6) D8(2.4,3.6) D9(3.2,3.6) E1(-3.2,2.8) E2(-2.4,2.8) E3(-1.6,2.8) E7(1.6,2.8) E8(2.4,2.8) E9(3.2,2.8) F1(-3.2,2) F2(-2.4,2) F3(-1.6,2) F7(1.6,2) F8(2.4,2) F9(3.2,2) G1(-3.2,1.2) G2(-2.4,1.2) G3(-1.6,1.2) G7(1.6,1.2) G8(2.4,1.2) G9(3.2,1.2) H1(-3.2,0.4) H2(-2.4,0.4) H3(-1.6,0.4) H7(1.6,0.4) H8(2.4,0.4) H9(3.2,0.4) J1(-3.2,-0.4) J2(-2.4,-0.4) J3(-1.6,-0.4) J7(1.6,-0.4) J8(2.4,-0.4) J9(3.2,-0.4) K1(-3.2,-1.2) K2(-2.4,-1.2) K3(-1.6,-1.2) K7(1.6,-1.2) K8(2.4,-1.2) K9(3.2,-1.2) L1(-3.2,-2) L2(-2.4,-2) L3(-1.6,-2) L7(1.6,-2) L8(2.4,-2) L9(3.2,-2) M1(-3.2,-2.8) M2(-2.4,-2.8) M3(-1.6,-2.8) M7(1.6,-2.8) M8(2.4,-2.8) M9(3.2,-2.8) N1(-3.2,-3.6) N2(-2.4,-3.6) N3(-1.6,-3.6) N7(1.6,-3.6) N8(2.4,-3.6) N9(3.2,-3.6) P1(-3.2,-4.4) P2(-2.4,-4.4) P3(-1.6,-4.4) P7(1.6,-4.4) P8(2.4,-4.4) P9(3.2,-4.4) R1(-3.2,-5.2) R2(-2.4,-5.2) R3(-1.6,-5.2) R7(1.6,-5.2) R8(2.4,-5.2) R9(3.2,-5.2) T1(-3.2,-6) T2(-2.4,-6) T3(-1.6,-6) T7(1.6,-6) T8(2.4,-6) T9(3.2,-6)
USIP-8_L3.0-W2.8-P0.65-TL-EP
  rect 0.65x0.45 smd: 1(-1.125,0.975) 2(-1.125,0.325) 3(-1.125,-0.325) 4(-1.125,-0.975) 5(1.125,-0.975) 6(1.125,-0.325) 7(1.125,0.325) 8(1.125,0.975)
  rect 1.1x1.9 smd: 9(0,0)

## Nets
As in the schematic, except:
+1.5V: C4.2 C10.1 C31.2 C32.2 C33.2 C34.2 C35.2 C36.2 C37.2 C38.2 C39.2 C51.1 C53.2 C54.2 C55.2 C56.1 C58.1 C60.1 C61.2 C62.2 C63.2 C64.2 C65.2 C66.2 C67.2 C68.2 C69.2 C75.2 C76.2 C77.2 C78.2 C79.2 C80.2 C81.2 C82.2 C83.2 NOREF#2.E10 NOREF#10.E10 R9.2 R14.1 R18.1 R22.1 R24.1 U4.4 U4.5 U15.A1 U15.A8 U15.B2 U15.C1 U15.C9 U15.D2 U15.D9 U15.E9 U15.F1 U15.G7 U15.H2 U15.H9 U15.K2 U15.K8 U15.N1 U15.N9 U15.R1 U15.R9 U16.A1 U16.A8 U16.B2 U16.C1 U16.C9 U16.D2 U16.D9 U16.E9 U16.F1 U16.G7 U16.H2 U16.H9 U16.K2 U16.K8 U16.N1 U16.N9 U16.R1 U16.R9 U17.A3 U17.D2 U17.E5 U17.G1 U17.H4 U17.L3 U17.P2 U17.R5 U17.U1 U17.V4
GND: C1.1 C2.1 C3.1 C4.1 C5.1 C6.1 C7.1 C8.1 C9.1 C11.1 C16.1 C17.1 C18.1 C19.1 C20.1 C21.1 C22.1 C23.1 C24.1 C25.1 C26.1 C27.1 C28.1 C29.1 C30.1 C31.1 C32.1 C33.1 C34.1 C35.1 C36.1 C37.1 C38.1 C39.1 C40.1 C41.1 C42.1 C43.1 C44.1 C45.1 C46.1 C47.1 C48.1 C49.1 C50.1 C52.2 C53.1 C54.1 C55.1 C57.2 C59.2 C60.2 C61.1 C62.1 C63.1 C64.1 C65.1 C66.1 C67.1 C68.1 C69.1 C70.1 C71.1 C72.1 C73.1 C74.2 C75.1 C76.1 C77.1 C78.1 C79.1 C80.1 C81.1 C82.1 C83.1 C84.1 C85.1 C86.1 C87.1 C88.1 C89.1 C90.1 C96.1 C97.1 C105.1 C106.1 C107.1 C108.1 C109.1 C110.2 C111.1 C112.1 C113.2 C114.2 C115.2 C116.2 C117.2 C118.2 C119.2 C120.2 LED1.1 NOREF.E10 NOREF#3.E10 NOREF#4.E10 NOREF#6.E10 NOREF#7.E10 NOREF#9.E10 NOREF#11.E10 R2.1 R5.1 R8.1 R10.1 R13.1 R15.2 R16.1 R17.1 R19.1 R20.1 R23.2 R25.2 R53.1 R56.2 R84.1 SW2.2 SW2.3 SW2.4 SW3.2 SW4.2 SW5.2 SW6.2 U1.3 U1.9 U2.3 U2.9 U3.3 U3.9 U4.3 U4.9 U5.3 U5.9 U13.1 U15.A9 U15.B1 U15.B3 U15.B9 U15.D1 U15.D8 U15.E1 U15.E2 U15.E8 U15.F9 U15.G1 U15.G8 U15.G9 U15.J2 U15.J8 U15.M1 U15.M9 U15.P1 U15.P9 U15.T1 U15.T9 U16.A9 U16.B1 U16.B3 U16.B9 U16.D1 U16.D8 U16.E1 U16.E2 U16.E8 U16.F9 U16.G1 U16.G8 U16.G9 U16.J2 U16.J8 U16.M1 U16.M9 U16.P1 U16.P9 U16.T1 U16.T9 U17.A5 U17.A8 U17.A18 U17.B1 U17.B8 U17.B11 U17.C4 U17.C9 U17.C14 U17.D6 U17.D8 U17.D17 U17.E10 U17.E20 U17.F3 U17.F7 U17.F10 U17.G10 U17.G12 U17.G16 U17.H7 U17.H9 U17.H11 U17.H13 U17.H19 U17.J2 U17.J8 U17.J10 U17.J12 U17.K5 U17.K7 U17.K10 U17.K11 U17.K13 U17.K15 U17.L8 U17.L9 U17.L12 U17.L18 U17.M1 U17.M7 U17.M9 U17.M10 U17.M11 U17.M13 U17.N4 U17.N8 U17.N10 U17.N12 U17.N14 U17.P7 U17.P9 U17.P11 U17.P13 U17.P17 U17.R8 U17.R12 U17.R20 U17.T3 U17.T7 U17.T13 U17.U6 U17.U16 U17.V9 U17.V19 U17.W2 U17.W12 U17.Y5 U17.Y15 U18.A6 U18.C4 U18.E7 U18.G5 U18.H10 U18.J5 U18.K8 U18.N2 U18.N5 U18.P4 U18.P6 U19.6 U20.1 U21.1 U22.1 U23.1 U24.1 U25.3 U25.9 X1.2 X2.2
DVREF: C49.2 C50.2 C56.2 C57.1 C70.2 C71.2 C72.2 C73.2 C74.1 NOREF#5.E10 NOREF#8.E10 R24.2 R25.1 RN1.5 RN1.6 RN1.7 RN1.8 RN2.5 RN2.6 RN2.7 RN2.8 RN3.5 RN3.6 RN3.7 RN3.8 RN4.5 RN4.6 RN4.7 RN4.8 RN5.5 RN5.6 RN5.7 RN5.8 RN6.5 RN6.6 RN6.7 RN6.8

Pads without a net: R86 1 2; U1 8; U2 8; U3 7 8; U4 7 8; U5 7 8; U15 J1 J9 L1 L9 M7; U16 J1 J9 L1 L9 M7; U17 A7 A10 A11 A12 A14 A15 A16 A17 A19 A20 B5 B9 B12 B13 B14 B17 B18 B19 B20 C5 C6 C8 C10 C11 C12 C13 C15 C16 C18 C20 D9 D10 D11 D13 D14 D15 D18 D19 D20 E6 E8 E9 E13 E14 E16 E17 E18 E19 F12 F14 F15 F16 F17 F19 F20 G14 G15 G17 G18 G19 G20 H15 H16 H17 H18 H20 J14 J15 J16 J18 J19 J20 K9 K14 K16 K18 K19 L10 L14 L15 L16 L17 L19 L20 M14 M15 M17 M18 M19 M20 N15 N16 N18 N20 P14 P15 P16 P19 P20 R14 R19 T5 T9 T10 T11 T12 T14 T15 T16 T19 T20 U5 U7 U8 U9 U10 U12 U13 U14 U15 U17 U18 U19 U20 V5 V6 V7 V8 V10 V11 V12 V13 V15 V16 V20 W6 W8 W9 W10 W11 W13 W14 W15 W16 W20 Y6 Y7 Y8 Y9 Y11 Y12 Y13 Y14 Y16 Y17 Y18 Y19; U18 A1 A2 A7 A8 A9 A10 A11 A12 A13 A14 B1 B3 B4 B5 B6 B7 B8 B9 B10 B11 B12 B13 B14 C1 C3 C5 C7 C8 C9 C10 C11 C12 C13 C14 D1 D2 D3 D4 D12 D13 D14 E1 E2 E3 E5 E8 E9 E10 E12 E13 E14 F1 F2 F3 F10 F12 F13 F14 G1 G2 G3 G10 G12 G13 G14 H1 H2 H3 H5 H12 H13 H14 J1 J2 J3 J12 J13 J14 K1 K2 K3 K6 K7 K10 K12 K13 K14 L1 L2 L3 L12 L13 L14 M1 M2 M3 M7 M8 M9 M10 M11 M12 M13 M14 N1 N3 N6 N7 N8 N9 N10 N11 N12 N13 N14 P1 P2 P7 P8 P9 P10 P11 P12 P13 P14; U19 7 8; U25 7 8; X3 1 2 3 4 5 6 7 8 9 10 11 12 13 14 15 16 17 18 19 20 21 22 23 24

## Via types
v1: diameter 0.399, hole 0.299, Top Layer to Bottom Layer, 439 vias

## Routing (per net, layer and track width the routed paths; a pad name or vN(x,y) marks a point on that pad's centre or on a via; arc(x,y) is an arc through that point)
1.8V: length 5.7
  Top Layer w0.127: 36.16,5.1 36.17,5.1 36.75,5.68 36.75,6.38 36.53,6.6 36.54,6.61 36.54,9.94 U17.D5
+1.0V: length 1.2
  Top Layer w0.127: R1.2 66.88,37.7 arc(66.84,37.6) v1(66.74,37.56)
  vias: v1(30.56,16.72) v1(30.56,15.12) v1(30.56,13.52) v1(32.16,13.52) v1(33.76,18.32) v1(34.56,19.12) v1(34.56,17.52) v1(34.56,15.92) v1(34.56,14.32) v1(34.58,12.73)
+1.2V:
  vias: v1(60.08,37.55)
+1.5V: length 23
  Top Layer w0.127: v1(48.76,27.72) 48.35,27.31 47.55,27.31 U16.A8 ; v1(54.36,8.92) 53.95,9.33 53.15,9.33 U15.H9 ; U15.N9 57.15,9.33 57.88,9.33 58.27,9.72 v1(58.36,9.72) ; U16.N1 57.16,21.72 57.97,21.72 v1(58.38,21.32)
  Top Layer w0.254: v1(48.75,21.32) 49.55,22.12 U16.D2 ; v1(63.93,1.42) 63.93,3.41 v1(63.94,3.42) ; v1(40.07,12.73) 40.06,12.72 U17.G1 ; U16.A1 47.27,21.32 v1(47.97,22.03) ; U15.A8 46.81,8.92 v1(46.42,9.3) ; v1(63.93,29.82) 63.93,28.83 v1(63.94,28.82) ; v1(38.75,18.37) 38.7,18.32 U17.P2 ; v1(49.56,27.72) U16.E9 ; v1(36.16,19.13) 36.16,19.13 U17.R5 ; v1(39.65,20.72) U17.U1
  Bottom Layer w0.254: C83.2 49.62,27.72 v1(48.76,27.72) ; v1(58.38,21.32) 58.38,21.33 57.98,21.72 57.1,21.72 C75.2 ; C68.2 37.76,7.17 v1(37.76,7.92) ; v1(39.65,20.72) C54.2 ; v1(48.75,21.32) 48.8,21.27 C39.2 ; v1(48.76,9.71) 49.6,9.71 C60.1
  Bottom Layer w0.508: v1(31.94,27.06) 31.94,28.02 31.96,28.05
  vias: v1(36.16,11.12) v1(36.98,21.52) v1(38.56,10.32) v1(47.16,3.32) v1(47.96,4.12) v1(48.76,3.32) v1(49.56,9.72) v1(49.56,4.12) v1(50.36,9.72) v1(51.09,21.32) v1(51.16,3.32) v1(51.96,26.12) v1(51.96,8.12) v1(52.76,27.72) v1(52.76,22.12) v1(52.76,4.12) v1(54.36,26.92) v1(54.36,22.12) v1(54.36,4.12) v1(56.72,37.58) v1(56.76,27.72) v1(56.76,3.32) v1(58.38,27.72) v1(58.36,3.32) v1(63.94,2.42)
+1.8V: length 1.9
  Top Layer w0.127: R3.2 63.58,37.68 arc(63.54,37.58) v1(63.44,37.53)
  Bottom Layer w0.508: v1(32.96,12.72) 32.96,12.16 C30.2
  vias: v1(27.36,16.72) v1(30.56,10.32) v1(31.36,14.32) v1(31.36,11.92) v1(32.16,18.32) v1(32.96,19.12) v1(32.96,17.52) v1(32.96,14.32) v1(33.76,19.92) v1(33.76,16.72) v1(33.76,15.12)
+3.3V: length 7.2
  信号层 w0.254: v1(35.36,19.92) 35.36,20.8
  Bottom Layer w0.127: U24.2 19.91,4.59 arc(19.84,4.78) v1(19.65,4.85)
  Bottom Layer w0.508: v1(35.36,15.12) v1(35.36,16.72) v1(35.36,17.52) v1(35.36,19.12) v1(35.36,19.92)
  vias: v1(34.56,10.32) v1(35.36,8.72) v1(53.35,37.59)
+5V:
  vias: v1(50.01,37.6)
GND: length 57.1
  Top Layer w0.127: v1(38.13,18.67) 38.13,19.55 U17.T3 ; 35.09,5.08 34.79,5.38 34.79,6.36 34.16,6.99 34.16,9.93 U17.D8 ; U15.A9 U15.B9 ; v1(39.84,16.85) 39.72,16.72 U17.M1 ; U16.P1 57.41,21.17
  Top Layer w0.254: U16.B1 47.96,20.99 v1(47.94,20.97) ; v1(49.56,26.92) v1(50.36,26.92) U16.F9 ; 54.96,28.92 54.26,28.22 52.46,28.22 U16.G9 ; 56.46,28.22 57.06,28.22 v1(57.56,27.72) 58.06,28.22 58.66,28.22 v1(59.16,27.72) ; 56.46,28.22 56.36,28.22 56.36,29.32 ; 56.46,28.22 v1(55.96,27.72) ; v1(66.69,1.42) 66.67,1.45 v1(66.67,4.42) ; v1(66.69,29.82) 66.69,28.83 v1(66.7,28.82) ; U16.G9 v1(51.55,27.72) U16.F9 ; U16.G9 v1(51.96,26.92) ; U16.F9 50.56,28.32 ; R16.1 55.96,11.06 v1(55.96,9.72) ; 48.56,28.35 47.96,27.75 U16.B9 U16.A9 45.96,28.92 ; v1(59.16,9.72) 59.06,9.72 58.54,10.24 58.08,10.24 U15.P9 ; U16.D1 v1(50.36,21.32) U16.E2 U16.D1
  Top Layer w0.508: R16.1 55.69,11.51 54.96,12.25 ; 57.5,21.09 57.19,20.78 56.5,20.78 v1(55.96,21.32) ; 57.73,20.68 58.84,20.68 59.1,20.94
  Bottom Layer w0.127: v1(36.16,7.92) 36.16,6.61 36.15,6.6
  Bottom Layer w0.254: v1(51.96,26.92) 51.76,27.12 ; v1(51.96,26.92) 51.96,28.02 ; v1(51.96,26.92) 52.06,27.02 52.06,27.92 ; 51.76,27.12 51.55,27.33 v1(51.55,27.72) ; 51.76,27.12 51.76,27.92 ; 56.46,28.32 56.46,28.22 v1(55.96,27.72) ; 59.19,9.72 59.19,9.39 58.79,9 56.86,9 56.14,9.72 v1(55.96,9.72) C86.1 ; 47.96,28.32 U16.B9 U16.A9 ; v1(59.16,9.72) 59.18,9.72 ; 50.56,28.32 50.56,27.12 v1(50.36,26.92) v1(49.56,26.92) ; v1(36.98,17.43) 37.57,16.84 C64.1 ; C67.1 37.83,10.37 v1(37.18,9.71) ; v1(53.56,26.92) 53.56,27.62
  vias: v1(20.9,4.85) v1(29.76,16.72) v1(29.76,15.12) v1(29.76,13.52) v1(31.36,18.32) v1(31.36,8.72) v1(31.94,24.97) v1(32.03,11.1) v1(32.16,17.52) v1(32.16,16.72) v1(32.16,15.12) v1(32.16,14.32) v1(32.16,12.72) v1(32.16,11.92) v1(32.96,18.32) v1(32.96,16.72) v1(32.96,15.92) v1(32.96,13.52) v1(32.96,9.52) v1(33.42,23.5) v1(33.76,19.12) v1(33.76,17.52) v1(33.76,15.92) v1(33.76,14.32) v1(33.76,8.72) v1(33.76,7.92) v1(34.56,19.92) v1(34.56,18.32) v1(34.56,16.72) v1(34.56,15.12) v1(34.56,13.52) v1(34.54,11.92) v1(35.13,2.38) v1(35.36,10.32) v1(35.76,21.23) v1(35.94,23.12) v1(36.2,15.27) v1(37.76,11.92) v1(38.56,22.32) v1(38.56,14.32) v1(39.36,8.72) v1(40.76,12.73) v1(40.96,20.72) v1(46.04,3.32) v1(46.58,22) v1(47.96,22.92) v1(47.95,9.69) v1(47.96,4.92) v1(47.96,3.32) v1(48.36,36.17) v1(49.04,36.75) v1(49.56,8.92) v1(49.56,3.32) v1(49.77,36.17) v1(50.36,8.92) v1(50.36,4.12) v1(50.36,3.32) v1(51.16,9.72) v1(51.7,36.16) v1(51.78,21.32) v1(51.96,9.72) v1(51.96,8.92) v1(51.96,3.32) v1(52.38,36.74) v1(53.11,36.17) v1(53.56,22.12) v1(53.56,8.92) v1(53.56,4.12) v1(55.07,36.15) v1(55.74,36.72) v1(55.96,3.32) v1(56.48,36.15) v1(56.47,28.81) v1(57.56,3.32) v1(58.43,36.12) v1(59.11,36.7) v1(59.19,21.32) v1(59.16,3.32) v1(59.84,36.13) v1(61.79,36.1) v1(61.76,1.52) v1(62.46,36.68) v1(62.56,1.52) v1(63.19,36.11) v1(64.89,27.54) v1(65.09,36.13) v1(65.24,7.2) v1(65.46,28.12) v1(65.77,36.71) v1(65.86,27.51) v1(66.5,36.13) v1(66.69,3.42) v1(66.7,2.42) v1(66.85,21.63) v1(66.84,9.38)
VCCPLL: length 3
  Bottom Layer w0.508: v1(33.76,12.72) 33.6,12.56 33.6,11.79 33.47,11.67 33.47,10.98
  Bottom Layer w0.762: 33.82,10.63 C6.2
(no net):
  vias: v1(34.56,7.92)
BOOT_MODE0:
  vias: v1(34.56,8.72) v1(35.36,7.92)
DVREF: length 7.6
  Bottom Layer w0.381: NOREF#5.E10 65.11,30.03 v1(65.32,29.82) 65.55,29.82 NOREF#8.E10
  Bottom Layer w0.508: v1(65.29,25.07) v1(66.49,25.07) 66.44,25.12 66.44,28.05 65.68,28.82 65.33,28.82 v1(65.32,28.81) 65.32,28.82 v1(65.32,29.82)
  vias: v1(66.85,20.77) v1(66.84,10.25)
EMMC_CLK: length 23.5
  信号层 w0.127: v1(16.36,20.67) 16.36,20.72 arc(16.58,21.25) 17.11,21.47 arc(19.29,20.57) 20.19,18.4 20.19,12.38 arc(20.64,11.28) 21.73,10.83 30.27,10.83 arc(30.47,10.91) v1(30.56,11.12)
EMMC_CMD: length 18.6
  信号层 w0.127: v1(26.56,9.52) 21.96,9.52 arc(20.17,10.27) 19.42,12.06 19.42,18.23 arc(18.71,19.97) v1(16.98,20.68)
EMMC_DAT0: length 21.8
  Bottom Layer w0.127: v1(18,15.22) 18,12.82 arc(17.99,12.71) 18,12.6 arc(18.12,12.15) 18.38,11.77 18.73,11.42 arc(18.95,11.33) 19.17,11.42 19.45,11.69 arc(19.89,11.69) 19.89,11.25 19.61,10.97 arc(19.51,10.75) 19.61,10.53 22.27,7.83 arc(22.71,7.44) 23.28,7.3 32.34,7.3 arc(32.78,7.48) v1(32.96,7.92)
EMMC_DAT1: length 21.8
  Bottom Layer w0.127: v1(29.76,11.92) 29.76,11.89 arc(29.65,11.62) 29.38,11.51 27.65,11.51 arc(27.11,11.29) 26.89,10.75 26.89,10.42 arc(26.74,10.04) 26.36,9.89 22.6,9.89 arc(21.9,10.18) 21.61,10.88 21.61,10.98 arc(21.73,11.29) 22.04,11.41 22.67,11.41 arc(22.8,11.46) 22.85,11.59 22.85,12.1 arc(22.79,12.24) 22.65,12.3 21.65,12.3 arc(21.42,12.39) 21.33,12.62 21.33,15.21 arc(20.99,16.04) 20.16,16.38 18.42,16.38 arc(17.7,16.09) v1(17.41,15.37)
EMMC_DAT2: length 21.8
  Bottom Layer w0.127: v1(16.83,15.2) arc(17.35,16.45) 18.61,16.97 20.11,16.97 arc(21.08,16.71) 21.78,15.98 arc(21.89,15.72) 21.97,15.45 arc(22,15.26) 22,15.08 22,14.52 arc(22.62,13.04) 24.1,12.43 29.71,12.43 arc(30.02,12.3) 30.14,12 30.14,10.7 arc(29.56,9.3) v1(28.16,8.72)
EMMC_DAT3: length 21.8
  Bottom Layer w0.127: v1(18.49,15.71) 19.8,15.71 arc(20.38,15.47) 20.62,14.89 20.62,14.58 arc(20.53,14.36) 20.3,14.27 18.97,14.27 arc(18.66,13.95) 18.97,13.64 20.3,13.64 arc(20.62,13.33) 20.3,13.01 18.97,13.01 arc(18.66,12.7) 18.97,12.39 20.3,12.39 arc(20.53,12.3) 20.62,12.08 20.62,11.61 arc(21.36,9.82) 23.16,9.08 26.59,9.08 arc(27.16,9.31) 27.4,9.89 27.4,10.28 arc(27.39,10.31) v1(27.36,10.32)
EMMC_RST: length 7.4
  Bottom Layer w0.127: 15.12,26.03 15.12,21.78 arc(15.7,20.38) v1(17.11,19.79)
FB_+1.0V: length 2.5
  Top Layer w0.127: R2.2 R1.1 arc(66.18,38.55) 66.09,38.33 U1.6
FB_+1.8V: length 2.5
  Top Layer w0.127: U2.6 62.79,38.3 arc(62.88,38.52) R3.1 R5.2
FPGA_TCK: length 7.2
  信号层 w0.127: v1(30.15,5.46) 30.15,8.83 31.31,9.99 31.62,9.99 32.61,10.98 32.61,11.46
FVREF: length 15.5
  Top Layer w0.127: U17.H6 35.76,13.92 35.76,17.93 U17.P6 34.92,18.77 34.92,23.83 v1(34.77,23.99)
  Bottom Layer w0.127: v1(34.77,23.99) 34.77,24.14 34.38,24.52 34.16,24.52 33.86,24.81 33.86,24.9
  Bottom Layer w0.508: 32.83,28.05 32.83,25.03 32.81,25.01
  vias: v1(35.15,13.17)
JTAG_TCK_II: length 3.5
  Top Layer w0.157: U19.1 14.65,7.62 arc(14.61,7.71) R72.2
  Bottom Layer w0.127: v1(14.65,4.82) 14.65,3.81 arc(14.63,3.76) U20.2
JTAG_TDI: length 12.2
  信号层 w0.127: v1(29.53,5.5) 29.53,8.75 31.18,10.4 31.18,11.08 31.77,11.67 31.77,12.12 31.97,12.33 32.35,12.33 32.61,12.58 32.61,12.99 32.76,13.14 33.17,13.14 33.37,13.34 33.7,13.34 33.95,13.09 34.74,13.09 35.23,12.59 v1(35.4,12.59)
JTAG_TDI_II: length 3.6
  Top Layer w0.157: R75.2 18.51,5.54 arc(18.48,5.46) U19.4
  Bottom Layer w0.127: U23.2 18.53,4.69 arc(18.49,4.79) v1(18.4,4.83)
JTAG_TDO: length 9.4
  信号层 w0.127: v1(31.03,5.59) 31.03,8.56 31.01,8.58 31.01,8.87 31.03,8.89 31.03,8.97 31.41,9.35 31.64,9.35 33.14,10.85 33.14,11.41 34.08,12.35 34.84,12.35 35.14,12.05 v1(35.15,12.05)
JTAG_TDO_II: length 3.5
  Top Layer w0.157: R74.2 17.19,5.47 arc(17.18,5.44) U19.3
  Bottom Layer w0.127: U22.2 17.21,4.76 arc(17.19,4.81) v1(17.15,4.83)
JTAG_TMS:
  vias: v1(28.72,5.47) v1(35.18,14.17)
JTAG_TMS_II: length 3.4
  Top Layer w0.157: R73.2 15.86,5.47 arc(15.87,5.44) U19.2
  Bottom Layer w0.127: U21.2 15.89,4.82 arc(15.89,4.82) v1(15.9,4.82)
MIPI_MCLK:
  vias: v1(26.56,19.12)
MIPI_PWDN:
  vias: v1(27.36,19.12)
MIPI_SIO_C:
  vias: v1(26.56,19.92)
MIPI_SIO_D:
  vias: v1(25.76,19.12)
PL_DONE: length 18.4
  Top Layer w0.127: 40.63,29.57 40.64,29.58 v1(41.85,29.58) ; v1(34.13,22.77) 34.13,19.67 34,19.54 31.78,19.54 U17.R11
  信号层 w0.127: v1(41.85,29.58) 41.85,29.29 36.03,23.47 35.79,23.47 35.08,22.77 v1(34.13,22.77)
  Bottom Layer w0.127: v1(41.85,29.58) 41.85,29.94
PL_MIPI_MCP:
  vias: v1(26.56,21.52)
PL_MIPI_MDN_1:
  vias: v1(25.76,18.32)
PL_MIPI_MDP_1:
  vias: v1(26.56,17.52)
PL_MIPI_MPN:
  vias: v1(25.76,21.52)
PS_CLK_33M: length 6.3
  Top Layer w0.127: R30.2 32.66,6.31 32.66,7.04 33.34,7.73 33.34,10.47 33.55,10.68 34.11,10.68 U17.E7
PS_MIO_VREF: length 7.5
  Top Layer w0.089: 31.72,10.11 31.97,9.86 32.5,9.86 32.58,9.79 32.58,7.25 32.2,6.86 v1(32.2,6.64)
  Top Layer w0.127: U17.E11 31.72,10.77 31.72,10.11
  Bottom Layer w0.508: R47.1 34.28,6.31 34.33,6.36
PS_POR: length 7
  信号层 w0.127: v1(37.77,4.27) 36.52,5.52 36.52,8.29 35.28,9.52 v1(34.56,9.52)
SA0: length 71.6
  Top Layer w0.127: RN4.3 63.32,20.51 63.52,20.31 63.52,20.11 63.32,19.91 63.32,19.59 61.56,17.84 60.13,17.84 59.95,17.67 59.95,17.37 59.8,17.22 59.51,17.22 59.14,16.85 arc(59.08,16.72) 59.14,16.58 arc(59.14,16.31) 58.87,16.31 arc(58.74,16.37) 58.6,16.31 v1(58.11,15.82) ; 58.11,6.82 58.11,6.07 57.87,5.83 57.69,5.83 56.78,4.92 U15.N3 ; U16.N3 56.78,22.92 57.69,23.83 57.87,23.83 58.11,24.07 58.11,24.82
  信号层 w0.127: v1(58.11,24.82) 58.11,21.61 57.96,21.45 57.96,21.19 58.11,21.04 v1(58.11,15.82) 58.11,10.02 57.97,9.88 57.97,9.56 58.11,9.42 v1(58.11,6.82) ; v1(50.95,13.98) 50.95,13.65 51.2,13.39 51.2,13.14 51,12.94 50.74,12.94 50.46,13.22 50.3,13.22 arc(50.17,13.27) 50.11,13.41 arc(49.92,13.6) 49.73,13.41 arc(49.54,13.22) 49.35,13.41 arc(49.16,13.6) 48.97,13.41 arc(48.91,13.27) 48.78,13.22 48.58,13.22 48.4,13.39 48.4,13.77 48.61,13.98 48.81,13.98 49.19,14.36 49.57,14.36 49.76,14.17 49.76,14.02 49.88,13.89 50.34,13.89 50.52,14.07 50.52,14.24 51.52,15.24 51.52,15.71 51.33,15.91 51.2,15.91 arc(51.07,15.85) 51.01,15.72 51.01,15.26 arc(50.82,15.07) 50.63,15.26 50.63,15.72 arc(50.58,15.85) 50.44,15.91 50.37,15.91 arc(50.23,15.85) 50.18,15.72 50.18,14.9 arc(49.99,14.71) 49.8,14.9 49.8,15.72 arc(49.74,15.85) 49.6,15.91 49.46,15.91 49.08,16.29 48.93,16.29 arc(48.79,16.34) 48.74,16.48 48.74,16.56 arc(48.55,16.75) 48.35,16.56 48.35,16.48 arc(48.16,16.29) 47.97,16.48 47.97,16.56 arc(47.78,16.75) 47.59,16.56 47.59,16.48 arc(47.4,16.29) 47.21,16.48 47.21,16.56 arc(47.02,16.75) 46.83,16.56 46.83,16.48 arc(46.64,16.29) 46.45,16.48 46.45,16.52 arc(46.26,16.71) 46.07,16.52 46.07,16.48 arc(46.01,16.34) 45.88,16.29 45.38,16.29 44.03,17.64 42.92,17.64 arc(42.79,17.58) 42.73,17.44 42.73,17.34 arc(42.54,17.15) 42.35,17.34 42.35,17.44 arc(42.3,17.58) 42.16,17.64 41.91,17.64 41.49,17.21 39.53,17.21 39.22,17.52 v1(38.56,17.52)
  Bottom Layer w0.127: v1(50.95,13.98) 51.35,13.57 56.89,13.57 58.11,14.79 v1(58.11,15.82)
SA1: length 71.6
  Top Layer w0.127: v1(59.01,6.82) 58.43,7.41 58.28,7.41 U15.P7 ; v1(59.01,15.82) 59.28,16.09 59.63,16.09 59.77,16.23 59.77,16.58 59.99,16.8 60.34,16.8 60.54,17 60.54,17.36 60.67,17.48 61.74,17.48 63.82,19.57 63.82,19.76 arc(63.88,19.89) 64.01,19.95 64.16,19.95 arc(64.35,20.14) 64.16,20.33 64.01,20.33 arc(63.88,20.39) 63.82,20.52 63.82,20.91 RN4.2 ; U17.K2 38.97,14.71 40.61,14.71 40.84,14.49 42.59,14.49 43.78,13.29 44.14,13.29 44.47,12.96 45,12.96 45.13,13.09 47.13,13.09 arc(47.26,13.14) 47.32,13.28 47.32,13.58 arc(47.51,13.77) 47.7,13.58 47.7,12.85 arc(47.89,12.66) 48.08,12.85 48.08,14.46 arc(48.27,14.65) 48.46,14.46 48.46,11.69 arc(48.65,11.5) 48.84,11.69 48.84,14.46 arc(49.03,14.65) 49.22,14.46 49.22,11.72 arc(49.41,11.53) 49.6,11.72 49.6,13.68 arc(49.79,13.87) 49.98,13.68 49.98,13.28 arc(50.18,13.09) 50.37,13.28 50.37,14.05 v1(50.13,14.28) ; U16.P7 58.28,25.41 58.43,25.41 v1(59.01,24.82)
  信号层 w0.127: v1(59.01,6.82) 59.01,9.02 59.55,9.56 59.55,9.88 59.01,10.42 v1(59.01,15.82) 59.01,20.6 59.58,21.16 59.58,22.26 59.01,22.82 v1(59.01,24.82)
  Bottom Layer w0.127: v1(50.13,14.28) 50.13,14.21 51.07,13.27 57.16,13.27 59.01,15.12 v1(59.01,15.82)
SA2: length 71.5
  Top Layer w0.127: RN3.3 63.82,11.46 63.59,11.69 arc(63.54,11.82) 63.59,11.96 63.68,12.04 arc(63.68,12.31) 63.41,12.31 63.32,12.23 arc(63.19,12.17) 63.05,12.23 62.93,12.35 62.73,12.35 61,14.08 59.7,14.08 v1(58.56,15.22) ; v1(58.56,24.22) 58.56,24.12 57.56,23.12 U16.P3 ; v1(51.89,19.79) 50.95,18.85 50.95,18.7 50.28,18.04 49.81,18.04 arc(49.67,17.99) 49.62,17.85 49.62,16.73 arc(49.42,16.54) 49.23,16.73 49.23,16.91 49.04,17.11 48.85,17.11 arc(48.71,17.05) 48.66,16.92 48.66,16.53 arc(48.47,16.34) 48.28,16.53 48.28,16.92 arc(48.09,17.11) 47.89,16.92 47.89,16.53 arc(47.7,16.34) 47.51,16.53 47.51,16.92 arc(47.46,17.05) 47.32,17.11 46.82,17.11 arc(46.63,17.3) 46.82,17.49 46.87,17.49 arc(47.01,17.54) 47.07,17.68 47.07,18.08 arc(47.26,18.27) 47.45,18.08 47.45,17.68 arc(47.5,17.54) 47.64,17.49 48.28,17.49 arc(48.42,17.54) 48.47,17.68 48.47,17.85 arc(48.42,17.99) 48.28,18.04 48.15,18.04 47.82,18.37 47.82,19.21 47.62,19.41 47.03,19.41 46.64,19.02 44.18,19.02 42,16.85 40.35,16.85 39.94,17.25 39.65,17.25 39.52,17.13 38.17,17.13 U17.M3 ; v1(58.56,6.22) 58.56,6.12 57.56,5.12 U15.P3
  信号层 w0.127: v1(58.56,6.22) 58.56,9.37 58.76,9.57 58.76,9.87 58.56,10.07 v1(58.56,15.22) 58.56,20.95 58.77,21.16 58.77,21.48 58.56,21.69 v1(58.56,24.22)
  Bottom Layer w0.127: v1(51.89,19.79) 55.87,19.79 55.98,19.69 arc(56.04,19.55) 55.98,19.42 55.77,19.2 arc(55.77,18.94) 56.04,18.94 56.26,19.15 arc(56.53,19.15) 56.53,18.88 56.31,18.67 arc(56.31,18.4) 56.58,18.4 56.79,18.61 arc(57.06,18.61) 57.06,18.34 56.85,18.13 arc(56.85,17.86) 57.12,17.86 57.33,18.07 arc(57.6,18.07) 57.6,17.8 57.39,17.59 arc(57.39,17.32) 57.65,17.32 57.87,17.53 arc(58,17.59) 58.14,17.53 58.56,17.11 v1(58.56,15.22)
SA3: length 71.6
  Top Layer w0.127: v1(59.46,15.22) 60.22,14.46 61.16,14.46 61.94,13.67 62.73,13.67 62.87,13.53 arc(62.93,13.4) 62.87,13.26 62.77,13.16 arc(62.77,12.89) 63.04,12.89 63.14,12.99 arc(63.28,13.05) 63.41,12.99 64.32,12.08 RN3.4 ; v1(59.46,24.22) 59.45,24.22 59.03,23.8 58.71,23.8 57.96,23.05 57.96,22.72 57.76,22.52 57.16,22.52 U16.N2 ; U15.N2 57.16,4.52 57.76,4.52 57.96,4.72 57.96,5.05 58.71,5.8 59.03,5.8 59.45,6.22 v1(59.46,6.22)
  信号层 w0.127: v1(46.78,13.62) 46.09,13.62 45.37,14.34 44.14,14.34 44.01,14.47 44.01,14.65 43.77,14.89 43.59,14.89 arc(43.45,14.84) 43.4,14.7 43.4,13.88 arc(43.21,13.69) 43.02,13.88 43.02,14.7 arc(42.83,14.89) 42.63,14.7 42.63,13.68 arc(42.44,13.49) 42.25,13.68 42.25,14.7 arc(42.2,14.84) 42.06,14.89 42.05,14.89 arc(41.85,14.81) 41.77,14.61 41.77,14.14 arc(41.58,13.95) 41.39,14.14 41.39,14.97 arc(41.2,15.16) 41.01,14.97 41.01,14.14 arc(40.82,13.95) 40.63,14.14 40.63,14.97 arc(40.44,15.16) 40.25,14.97 40.25,14.14 arc(40.06,13.95) 39.87,14.14 39.87,14.97 arc(39.68,15.16) 39.48,14.97 39.48,14.35 arc(39.29,14.16) 39.1,14.35 39.1,14.97 arc(38.91,15.16) 38.72,14.97 38.72,14.9 arc(38.53,14.71) 38.34,14.9 38.34,14.97 arc(38.29,15.11) 38.15,15.16 37.8,15.16 v1(37.76,15.12) ; v1(59.46,24.22) 59.46,22.73 59.83,22.36 59.83,20.82 59.46,20.45 v1(59.46,15.22) 59.46,10.52 59.83,10.16 59.83,9.36 59.46,8.99 v1(59.46,6.22)
  Bottom Layer w0.127: v1(59.46,15.22) 59.46,14.92 57.46,12.91 50.96,12.91 50.25,13.62 v1(46.78,13.62)
SA4: length 71.6
  Top Layer w0.127: RN6.3 65.2,19.31 64.89,19 arc(64.83,18.87) 64.89,18.73 65,18.62 arc(65,18.35) 64.73,18.36 64.62,18.46 arc(64.35,18.46) 64.35,18.19 64.89,17.66 arc(64.89,17.39) 64.62,17.39 64.08,17.92 arc(63.81,17.92) 63.81,17.66 arc(63.81,17.39) 63.54,17.39 arc(63.41,17.44) 63.27,17.39 v1(61.71,15.82) ; 61.71,6.82 61.28,7.25 60.85,7.25 59.58,8.52 57.96,8.52 U15.P8 ; v1(47.26,19.01) 46.65,18.4 44.06,18.4 43.71,18.05 43.71,17.86 42.18,16.33 37.35,16.33 U17.M4 ; U16.P8 57.96,26.52 60.01,26.52 61.71,24.82
  信号层 w0.127: v1(61.71,6.82) v1(61.71,15.82) v1(61.71,24.82)
  Bottom Layer w0.127: v1(61.71,15.82) 60.71,16.83 arc(60.57,16.88) 60.44,16.83 60.25,16.63 arc(59.98,16.63) 59.98,16.9 60.17,17.09 arc(60.17,17.36) 59.9,17.36 59.73,17.19 arc(59.46,17.19) 59.46,17.46 59.63,17.63 arc(59.63,17.9) 59.36,17.9 59.19,17.73 arc(58.92,17.73) 58.92,18 59.09,18.17 arc(59.09,18.44) 58.82,18.44 58.66,18.28 arc(58.39,18.28) 58.39,18.55 58.55,18.71 arc(58.55,18.98) 58.28,18.98 58.08,18.77 arc(57.81,18.77) 57.81,19.04 58.01,19.25 arc(58.01,19.52) 57.74,19.52 57.52,19.3 arc(57.25,19.3) 57.25,19.57 57.48,19.79 arc(57.53,19.92) 57.48,20.06 57.32,20.22 47.78,20.22 47.26,19.7 v1(47.26,19.01)
SA5: length 71.6
  Top Layer w0.127: RN1.3 65.83,12.2 65.52,12.51 65.52,13.09 arc(65.57,13.22) 65.71,13.28 66,13.28 arc(66.19,13.47) 66,13.66 65.71,13.66 arc(65.57,13.71) 65.52,13.85 65.52,14.64 65.33,14.83 64.96,14.83 arc(64.83,14.78) 64.77,14.64 64.77,14.42 arc(64.58,14.23) 64.39,14.42 64.39,14.64 arc(64.2,14.83) 64.01,14.64 64.01,14.55 arc(63.82,14.36) 63.63,14.55 63.63,14.64 arc(63.57,14.78) 63.44,14.83 62.84,14.83 62.45,15.22 v1(62.16,15.22) ; U17.L1 39.37,15.92 42.34,15.92 42.83,16.41 43.8,16.41 44.1,16.71 45.73,16.71 v1(46.12,17.1) ; U16.P2 57.84,22.12 58.24,22.52 60.1,22.52 61.18,23.6 61.54,23.6 62.16,24.22 v1(62.16,24.22) ; v1(62.16,6.22) 62.16,6.22 60.46,4.52 58.24,4.52 57.84,4.12 U15.P2
  信号层 w0.127: v1(62.16,6.22) v1(62.16,15.22) v1(62.16,24.22) ; v1(51.35,20.63) 51.34,20.62 51.34,19.37 51.81,18.91 51.81,17.25 50.89,16.34 49.73,16.34 48.96,17.1 v1(46.12,17.1)
  Bottom Layer w0.127: v1(51.35,20.63) 51.48,20.76 57.47,20.76 57.8,20.43 arc(57.94,20.37) 58.07,20.43 arc(58.34,20.43) 58.34,20.16 arc(58.34,19.89) 58.61,19.89 arc(58.88,19.89) 58.88,19.62 arc(58.88,19.35) 59.15,19.35 arc(59.42,19.35) 59.42,19.08 arc(59.42,18.81) 59.69,18.81 arc(59.96,18.81) 59.96,18.54 arc(59.96,18.27) 60.23,18.27 arc(60.5,18.27) 60.5,18 arc(60.5,17.73) 60.77,17.73 arc(61.04,17.73) 61.04,17.46 arc(60.98,17.33) 61.04,17.19 61.3,16.94 61.75,16.94 62.17,16.52 62.17,15.23 v1(62.16,15.22)
SA6: length 71.5
  Top Layer w0.127: U15.R8 58.76,9.32 59.92,9.32 61.23,8.01 62.32,8.01 v1(63.51,6.82) ; v1(44.82,13.39) 44.82,13.52 43.03,15.31 41.61,15.31 41.4,15.52 37.36,15.52 U17.L4 ; v1(63.51,24.82) 61.01,27.32 58.76,27.32 U16.R8 ; RN6.1 66.11,18.31 66.98,17.44 66.98,16.09 66.71,15.82 66.67,15.82 arc(66.53,15.88) 66.48,16.01 66.48,17.09 arc(66.29,17.28) 66.1,17.09 66.1,16.01 arc(66.04,15.88) 65.9,15.82 v1(63.51,15.82)
  信号层 w0.127: v1(63.51,6.82) v1(63.51,15.82) v1(63.51,24.82)
  Bottom Layer w0.127: v1(63.51,15.82) 63.51,14.63 59.1,10.22 48.08,10.22 44.91,13.39 v1(44.82,13.39)
SA7: length 71.6
  Top Layer w0.127: U15.R2 58.76,3.72 60.56,3.72 63.06,6.22 ; RN1.4 67,13.69 67,14.96 66.78,15.17 arc(66.73,15.21) 66.67,15.22 arc(66.53,15.17) 66.48,15.03 66.48,14.18 arc(66.29,13.99) 66.1,14.18 66.1,15.03 arc(66.04,15.17) 65.9,15.22 v1(63.06,15.22) ; U16.R2 58.76,21.72 59.4,21.72 59.81,22.13 60.27,22.13 61.26,23.12 61.96,23.12 63.06,24.22
  信号层 w0.127: v1(36.96,15.12) 36.96,14.77 37.44,14.28 37.84,14.28 38.19,13.93 38.71,13.93 39.03,13.61 41.28,13.61 41.84,13.05 43.01,13.05 43.86,12.2 44.21,12.2 45.43,13.42 v1(45.43,13.5) ; v1(63.06,24.22) v1(63.06,15.22) v1(63.06,6.22)
  Bottom Layer w0.127: v1(63.06,15.22) 63.06,14.68 58.93,10.55 48.35,10.55 48.11,10.79 arc(48.05,10.93) 48.11,11.06 arc(48.11,11.33) 47.84,11.33 arc(47.57,11.33) 47.57,11.6 arc(47.57,11.87) 47.3,11.87 arc(47.03,11.87) 47.03,12.14 arc(47.03,12.41) 46.76,12.41 arc(46.63,12.35) 46.49,12.41 45.43,13.47 v1(45.43,13.5)
